# Altium project RF_Board_REV-B.PrjPcb
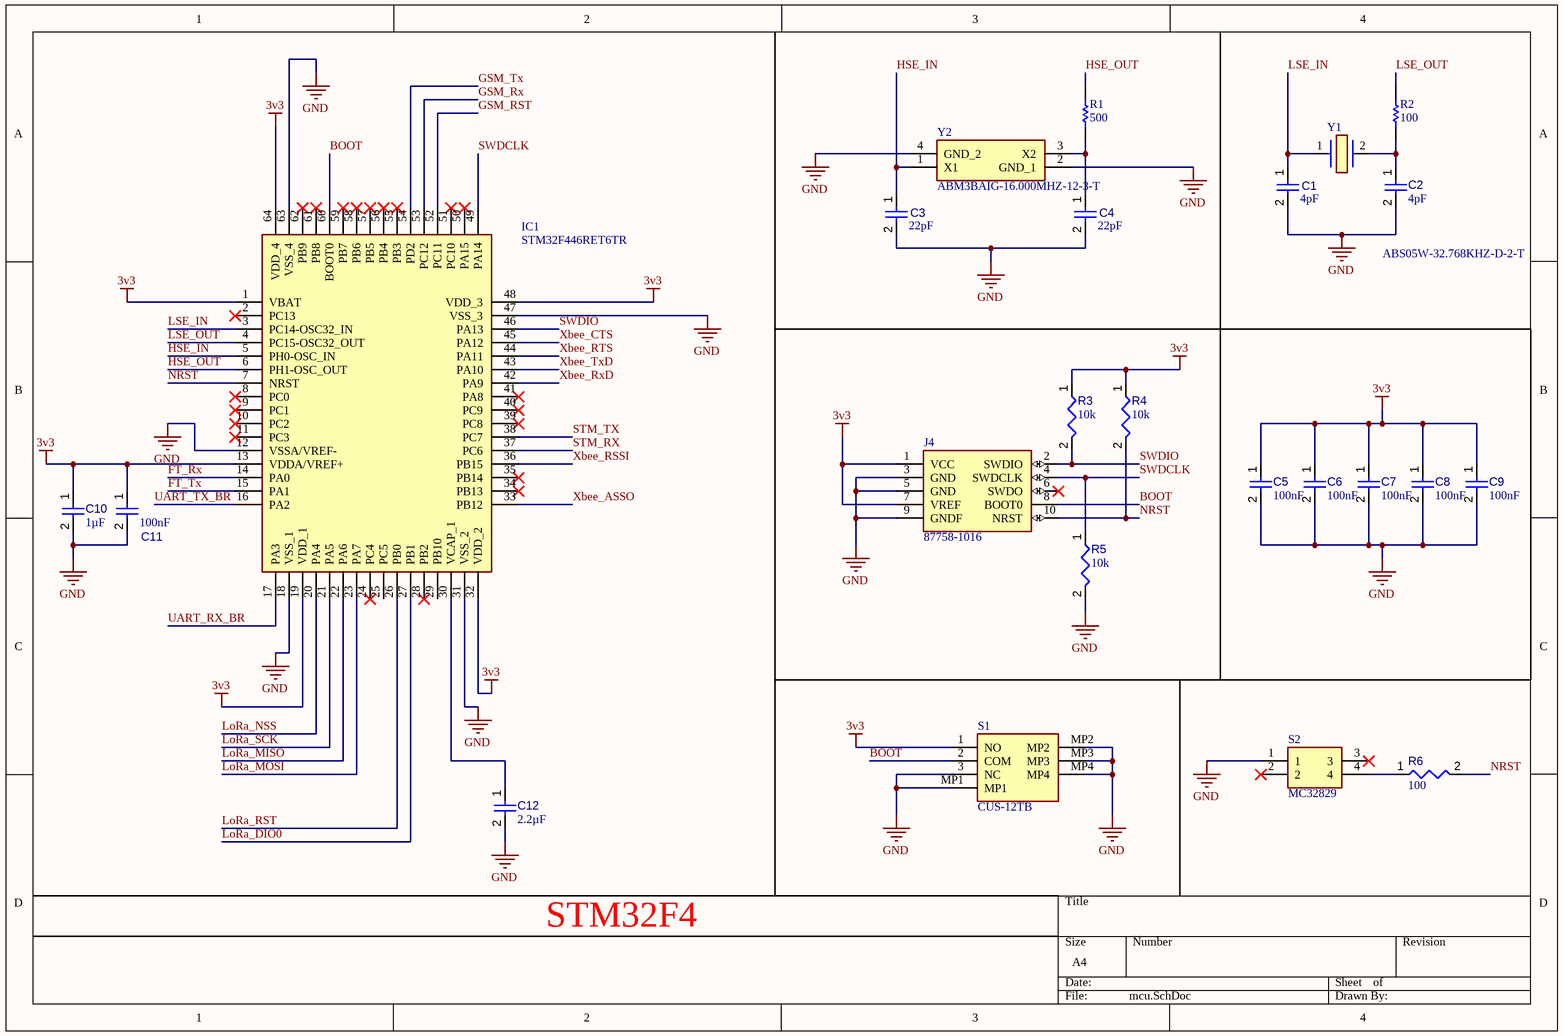
[diagram p0:  mcu.SchDoc]
3 sheets, 53 parts. Net scope: global (net labels, ports and power ports of the same name join across sheets).
Board file:  RFPCB_REV-A.PcbDoc
Sheets:
   mcu.SchDoc
   Xbee.SchDoc
   LoRa.SchDoc

## Sheet  mcu.SchDoc
size A4; SheetNumber: 1; SheetTotal: 3

### Parts
C1  value 4pF  [CAPC1608X90X40LL10T20]  (hidden comment: Capacitor 1 uF +/- 10% 25 V 0603)
C2  value 4pF  [CAPC1608X90X40LL10T20]  (hidden comment: Capacitor 1 uF +/- 10% 25 V 0603)
C3  value 22pF  [CAPC1608X90X40LL10T20]  (hidden comment: Capacitor 1 uF +/- 10% 25 V 0603)
C4  value 22pF  [CAPC1608X90X40LL10T20]  (hidden comment: Capacitor 1 uF +/- 10% 25 V 0603)
C5  value 100nF  [CAPC1608X90X40NL10T20]  (hidden comment: Capacitor 100 nF +/-10% 50 V 0603)
C6  value 100nF  [CAPC1608X90X40NL10T20]  (hidden comment: Capacitor 100 nF +/-10% 50 V 0603)
C7  value 100nF  [CAPC1608X90X40NL10T20]  (hidden comment: Capacitor 100 nF +/-10% 50 V 0603)
C8  value 100nF  [CAPC1608X90X40NL10T20]  (hidden comment: Capacitor 100 nF +/-10% 50 V 0603)
C9  value 100nF  [CAPC1608X90X40NL10T20]  (hidden comment: Capacitor 100 nF +/-10% 50 V 0603)
C10  value 1µF  [CAPC2013X135X45NL10T25]  (hidden comment: Capacitor 1 uF +/- 10% 50 V 0805)
C11  value 100nF  [CAPC1608X90X40NL10T20]  (hidden comment: Capacitor 100 nF +/-10% 50 V 0603)
C12  value 2.2µF  [CAPC2013X135X45NL10T25]  (hidden comment: Capacitor 1 uF +/- 10% 50 V 0805)
IC1  STM32F446RET6TR  [QFP50P1200X1200X160-64N]
J4  87758-1016  [HDRV10W75P200_2X5_990X400X595P]
R1  value 500  [RESC1005X40X25ML05T05]  (hidden comment: Resistor 0R +/- 5% 0402 100 mW)
R2  value 100  [RESC1005X40X25ML05T05]  (hidden comment: Resistor 0R +/- 5% 0402 100 mW)
R3  value 10k  [RESC1608X55X25ML10T15]  (hidden comment: Resistor 10k +/-1% 0603 100 mW)
R4  value 10k  [RESC1608X55X25ML10T15]  (hidden comment: Resistor 10k +/-1% 0603 100 mW)
R5  value 10k  [RESC1608X55X25ML10T15]  (hidden comment: Resistor 10k +/-1% 0603 100 mW)
R6  value 100  [RESC1608X55X25ML10T15]  (hidden comment: Resistor 10k +/-1% 0603 100 mW)
S1  CUS-12TB  [CUS12TB]
S2  MC32829  [MC32829]
Y1  ABS05W-32.768KHZ-D-2-T  [ABS05W32768KHZD2T]
Y2  ABM3BAIG-16.000MHZ-12-3-T  [ABM3BAIG]

### Nets
3v3: C5.1 C6.1 C7.1 C8.1 C9.1 C10.1 C11.1 IC1.1(VBAT) IC1.13(VDDA/VREF+) IC1.19(VDD_1) IC1.32(VDD_2) IC1.48(VDD_3) IC1.64(VDD_4) J4.1(VCC) J4.7(VREF) R3.1 R4.1 S1.1(NO)
GND: C1.2 C2.2 C3.2 C4.2 C5.2 C6.2 C7.2 C8.2 C9.2 C10.2 C11.2 C12.2 IC1.12(VSSA/VREF-) IC1.18(VSS_1) IC1.31(VSS_2) IC1.47(VSS_3) IC1.63(VSS_4) J4.3(GND) J4.5(GND) J4.9(GNDF) R5.2 S1.3(NC) S1.MP1 S1.MP2 S1.MP3 S1.MP4 S2.1 Y2.2(GND_1) Y2.4(GND_2)
BOOT: IC1.60(BOOT0) J4.8(BOOT0) S1.2(COM)
FT_Rx: IC1.14(PA0)
FT_Tx: IC1.15(PA1)
GSM_RST: IC1.52(PC11)
GSM_Rx: IC1.53(PC12)
GSM_Tx: IC1.54(PD2)
HSE_IN: C3.1 IC1.5(PH0-OSC_IN) Y2.1(X1)
HSE_OUT: IC1.6(PH1-OSC_OUT) R1.2
LoRa_DIO0: IC1.27(PB1)
LoRa_MISO: IC1.22(PA6)
LoRa_MOSI: IC1.23(PA7)
LoRa_NSS: IC1.20(PA4)
LoRa_RST: IC1.26(PB0)
LoRa_SCK: IC1.21(PA5)
LSE_IN: C1.1 IC1.3(PC14-OSC32_IN) Y1.1
LSE_OUT: IC1.4(PC15-OSC32_OUT) R2.2
NRST: IC1.7(NRST) J4.10(NRST) R4.2 R6.2
STM_RX: IC1.37(PC6)
STM_TX: IC1.38(PC7)
SWDCLK: IC1.49(PA14) J4.4(SWDCLK) R5.1
SWDIO: IC1.46(PA13) J4.2(SWDIO) R3.2
UART_RX_BR: IC1.17(PA3)
UART_TX_BR: IC1.16(PA2)
Xbee_ASSO: IC1.33(PB12)
Xbee_CTS: IC1.45(PA12)
Xbee_RSSI: IC1.36(PB15)
Xbee_RTS: IC1.44(PA11)
Xbee_RxD: IC1.42(PA9)
Xbee_TxD: IC1.43(PA10)
NetC2_1: C2.1 R2.1 Y1.2
NetC4_1: C4.1 R1.1 Y2.3(X2)
NetC12_1: C12.1 IC1.30(VCAP_1)
NetR6_1: R6.1 S2.4

Not connected (* = marked no-connect by the designer): IC1 2(PC13)* 8(PC0)* 9(PC1)* 10(PC2)* 11(PC3)* 24(PC4)* 25(PC5) 28(PB2)* 29(PB10) 34(PB13)* 35(PB14)* 39(PC8)* 40(PC9)* 41(PA8)* 50(PA15)* 51(PC10)* 55(PB3)* 56(PB4)* 57(PB5)* 58(PB6)* 59(PB7)* 61(PB8)* 62(PB9)*; J4 6(SWDO)*; S2 2* 3*

### Notes on the sheet
- STM32F4

### Library data of the parts
C1-C4 = CMP-001-00005-6: Chip Capacitor, 1 uF, +/- 10%, 25 V, 0603 (1608 Metric); Capacitor Type: Ceramic; Voltage Rating: 25V; Pins: 2; Mounting Technology: SM; RoHS Compliant: True; Max Operating Temperature: 125°C; Case/Package: 0603; Min Operating Temperature: -55°C; Tolerance: 10%
C5-C9 C11 = CMP-001-00017-6: Chip Capacitor, 100 nF, +/- 10%, 50 V, 0603 (1608 Metric); Voltage Rating: 50V; Capacitor Type: Ceramic; Tolerance: 10%; Mounting Technology: SM; Max Operating Temperature: 125°C; RoHS Compliant: True; Pins: 2; Case/Package: 0603; Min Operating Temperature: -55°C
C10 C12 = CMP-001-00007-6: Chip Capacitor, 1 uF, +/- 10%, 50 V, 0805 (2012 Metric); Capacitor Type: Ceramic; Voltage Rating: 50V; Min Operating Temperature: -55°C; RoHS Compliant: True; Mounting Technology: SM; Case/Package: 0805; Max Operating Temperature: 125°C; Tolerance: 10%; Pins: 2
IC1 = STM32F446RET6TR: Integrated Circuit; Manufacturer_Name: STMicroelectronics; Datasheet Link: https://www.arrow.com/en/products/stm32f446ret6tr/stmicroelectronics; Height: 1.6mm; Manufacturer_Part_Number: STM32F446RET6TR; Mouser Part Number: 511-STM32F446RET6TR; Mouser Price/Stock: https://www.mouser.co.uk/ProductDetail/STMicroelectronics/STM32F446RET6TR?qs=xZ%2FP%252Ba9zWqYaBJrnMqQZtg%3D%3D; Arrow Part Number: STM32F446RET6TR; Arrow Price/Stock: https://www.arrow.com/en/products/stm32f446ret6tr/stmicroelectronics?utm_currency=USD&region=nac
J4 = 87758-1016: Connector; Manufacturer_Name: Molex; Datasheet Link: http://www.molex.com/pdm_docs/sd/877581016_sd.pdf; Height: 5.95mm; Manufacturer_Part_Number: 87758-1016; Mouser Part Number: 538-87758-1016; Mouser Price/Stock: https://www.mouser.co.uk/ProductDetail/Molex/87758-1016?qs=9Wl4wMk6NjrOw5AcqxMewg%3D%3D; Arrow Part Number: 87758-1016; Arrow Price/Stock: https://www.arrow.com/en/products/87758-1016/molex?region=nac
R1 R2 = CMP-009-00005-5: Chip Resistor, 0 Ohm, 0.1 W, -55 to 155 degC, 0402 (1005 Metric); Power: 100mW; Voltage Rating: 50V; Pins: 2; Tolerance: 5%; Case/Package: 0402; Mounting Technology: SM; Max Operating Temperature: 155°C; Min Operating Temperature: -55°C; RoHS Compliant: True
R3-R6 = CMP-009-00017-5: Chip Resistor, 10 KOhm, +/- 1%, 01 W, -55 to 155 degC, 0603 (1608 Metric); Voltage Rating: 50V; Power: 100mW; RoHS Compliant: True; Min Operating Temperature: -55°C; Pins: 2; Case/Package: 0603; Mounting Technology: SM; Max Operating Temperature: 155°C; Tolerance: 1%
S1 = CUS-12TB: Switch; Manufacturer_Name: Nidec Copal; Datasheet Link: https://www.nidec-copal-electronics.com/e/catalog/switch/cus.pdf; Height: 1.4mm; Manufacturer_Part_Number: CUS-12TB; Mouser Part Number: 229-CUS-12TB; Mouser Price/Stock: https://www.mouser.co.uk/ProductDetail/Nidec-Components/CUS-12TB?qs=XeJtXLiO41Q1Ug1dC3Bq%2FQ%3D%3D
S2 = MC32829: Switch; Manufacturer_Name: Multicomp Pro; Datasheet Link: http://www.farnell.com/datasheets/2945655.pdf; Height: 6mm; Manufacturer_Part_Number: MC32829
Y1 = ABS05W-32.768KHZ-D-2-T: Crystal or Oscillator; Manufacturer_Name: ABRACON; Datasheet Link: https://abracon.com/Resonators/ABS05W.pdf; Height: 0.5mm; Manufacturer_Part_Number: ABS05W-32.768KHZ-D-2-T; Mouser Part Number: 815-ABS05W32.768KD2T; Mouser Price/Stock: https://www.mouser.co.uk/ProductDetail/ABRACON/ABS05W-32.768KHZ-D-2-T?qs=r5DSvlrkXmJ0aADBg3hvfA%3D%3D; Arrow Part Number: ABS05W-32.768KHZ-D-2-T; Arrow Price/Stock: https://www.arrow.com/en/products/abs05w-32.768khz-d-2-t/abracon?utm_currency=USD&region=nac
Y2 = ABM3BAIG-16.000MHZ-12-3-T: Crystal or Oscillator; Manufacturer_Name: ABRACON; Datasheet Link: https://abracon.com/AIGcrystals/ABM3BAIG.pdf; Height: 0.9mm; Manufacturer_Part_Number: ABM3BAIG-16.000MHZ-12-3-T

## Sheet  Xbee.SchDoc
size A4; SheetNumber: 2; SheetTotal: 3
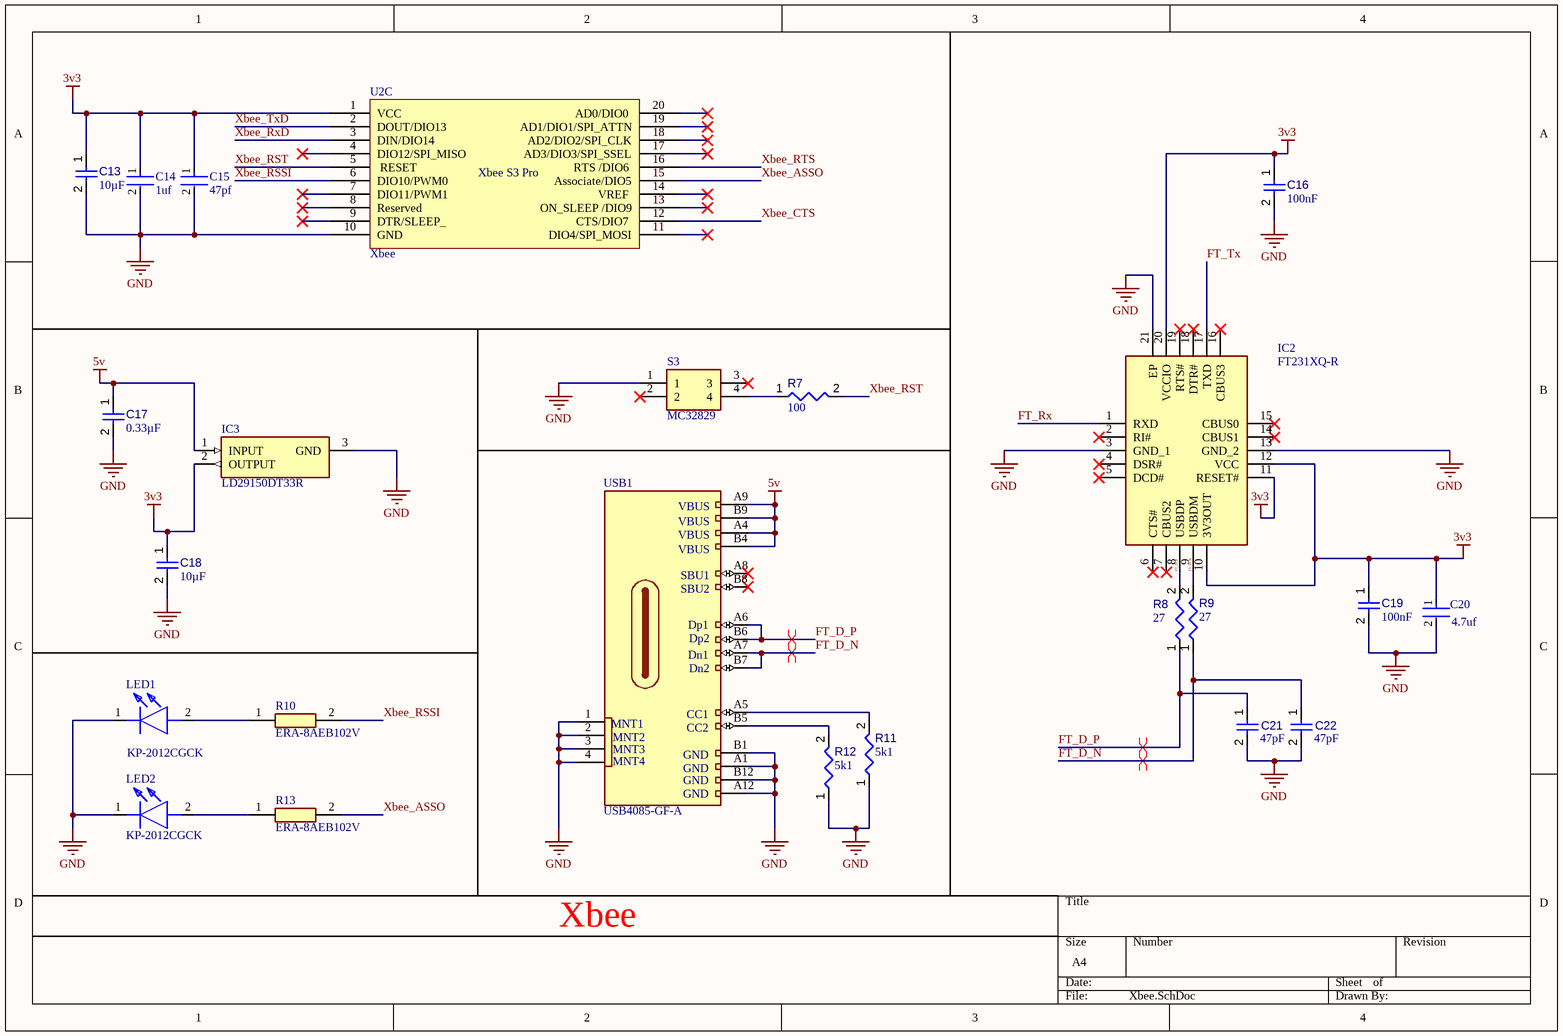
[diagram p1:  Xbee.SchDoc]

### Parts
C13  value 10µF  [CAPC3216X180X50NL20T25]  (hidden comment: Capacitor 10 uF +/- 10% 16 V 1206)
C14  1uf  [FP-CC0805-0_85-MFG]
C15  47pf  [FP-0603-L_1_6_0_15-W_0_81-IPC_A]
C16  value 100nF  [CAPC1608X90X40NL10T20]  (hidden comment: Capacitor 100 nF +/-10% 50 V 0603)
C17  value 0.33µF  [CAPC3216X180X50NL20T25]  (hidden comment: Capacitor 10 uF +/- 10% 16 V 1206)
C18  value 10µF  [CAPC3216X180X50NL20T25]  (hidden comment: Capacitor 10 uF +/- 10% 16 V 1206)
C19  value 100nF  [CAPC1608X90X40NL10T20]  (hidden comment: Capacitor 100 nF +/-10% 50 V 0603)
C20  4.7uf  [FP-CC0805-0_85-MFG]
C21  value 47pF  [CAPC1608X90X40LL10T20]  (hidden comment: Capacitor 1 uF +/- 10% 25 V 0603)
C22  value 47pF  [CAPC1608X90X40LL10T20]  (hidden comment: Capacitor 1 uF +/- 10% 25 V 0603)
IC2  FT231XQ-R  [QFN50P400X400X80-21N]
IC3  LD29150DT33R  [ST_DPAK_1]
LED1  KP-2012CGCK  [LEDC2012X110N]
LED2  KP-2012CGCK  [LEDC2012X110N]
R7  value 100  [RESC1608X55X25ML10T15]  (hidden comment: Resistor 10k +/-1% 0603 100 mW)
R8  value 27  [RESC1608X55X25ML10T15]  (hidden comment: Resistor 10k +/-1% 0603 100 mW)
R9  value 27  [RESC1608X55X25ML10T15]  (hidden comment: Resistor 10k +/-1% 0603 100 mW)
R10  ERA-8AEB102V  [RESC3216X70N]
R11  value 5k1  [RESC1608X55X25ML10T15]  (hidden comment: Resistor 10k +/-1% 0603 100 mW)
R12  value 5k1  [RESC1608X55X25ML10T15]  (hidden comment: Resistor 10k +/-1% 0603 100 mW)
R13  ERA-8AEB102V  [RESC3216X70N]
S3  MC32829  [MC32829]
U2  Xbee  [Xbee]  (part C of 3)
USB1  USB4085-GF-A  [USB4085-GF-A]

### Nets
3v3: C13.1 C14.1 C15.1 C16.1 C18.1 C19.1 C20.1 IC2.10(3V3OUT) IC2.11(RESET#) IC2.12(VCC) IC2.20(VCCIO) IC3.2(OUTPUT) U2.1(VCC)
5v: C17.1 IC3.1(INPUT) USB1.A4(VBUS) USB1.A9(VBUS) USB1.B4(VBUS) USB1.B9(VBUS)
GND: C13.2 C14.2 C15.2 C16.2 C17.2 C18.2 C19.2 C20.2 C21.2 C22.2 IC2.3(GND_1) IC2.13(GND_2) IC2.21(EP) IC3.3(GND) LED1.1(K) LED2.1(K) R11.1 R12.1 S3.1 U2.10(GND) USB1.1(MNT_1) USB1.2(MNT_2) USB1.3(MNT_3) USB1.4(MNT_4) USB1.A1(GND) USB1.A12(GND) USB1.B1(GND) USB1.B12(GND)
FT_D_N: C22.1 IC2.9(USBDM) R9.1 R9.2 USB1.A7(Dn1) USB1.B7(Dn2)
FT_D_P: C21.1 IC2.8(USBDP) R8.1 R8.2 USB1.A6(Dp1) USB1.B6(Dp2)
FT_Rx: IC2.1(RXD)
FT_Tx: IC2.17(TXD)
Xbee_ASSO: R13.2 U2.15(Associate/DIO5)
Xbee_CTS: U2.12(CTS/DIO7)
Xbee_RSSI: R10.2 U2.6(DIO10/PWM0)
Xbee_RST: R7.2 U2.5(RESET)
Xbee_RTS: U2.16(RTS_/DIO6)
Xbee_RxD: U2.3(DIN/DIO14)
Xbee_TxD: U2.2(DOUT/DIO13)
NetLED1_2: LED1.2(A) R10.1
NetLED2_2: LED2.2(A) R13.1
NetR7_1: R7.1 S3.4
NetR11_2: R11.2 USB1.A5(CC1)
NetR12_2: R12.2 USB1.B5(CC2)

Not connected (* = marked no-connect by the designer): IC2 2(RI#)* 4(DSR#)* 5(DCD#)* 6(CTS#)* 7(CBUS2)* 14(CBUS1)* 15(CBUS0)* 16(CBUS3)* 18(DTR#)* 19(RTS#)*; S3 2* 3*; U2 4(DIO12/SPI_MISO)* 7(DIO11/PWM1_)* 8(Reserved_)* 9(DTR/SLEEP_)* 11(DIO4/SPI_MOSI)* 13(ON_SLEEP_/DIO9)* 14(VREF_)* 17(AD3/DIO3/SPI_SSEL)* 18(AD2/DIO2/SPI_CLK)* 19(AD1/DIO1/SPI_ATTN)* 20(AD0/DIO0_)*; USB1 A8(SBU1)* B8(SBU2)*

### Layout directives
differential pair: FT_D_N, FT_D_P

### Notes on the sheet
- Xbee

### Library data of the parts
C13 C17 C18 = CMP-001-00016-6: Chip Capacitor, 10 uF, +/- 10%, 16 V, 1206 (3216 Metric); Capacitor Type: Ceramic; Voltage Rating: 16V; Tolerance: 10%; Min Operating Temperature: -55°C; Pins: 2; Mounting Technology: SM; Case/Package: 1206; Max Operating Temperature: 125°C; RoHS Compliant: True
C14 C20 = CMP-2100-03606-3: CAP CER 0.1UF 50V X7R 0805; Manufacturer Part Number: CC0805KRX7R9BB104; Manufacturer: Yageo; Tolerance: 0.1; Capacitance: 100 nF; Value: 100 nF; Material: Ceramic; Device Class L1: Passive Components; ComponentLink2Description: Datasheet; Package: CC0805-0.85; Digikey Description: CAP CER 0.1UF 50V X7R 0805; Device Class L3: Ceramic Capacitors; Temperature: -30°C to +85°C; Temperature Characteristic: X7R; Voltage Rating: 50 V; Height: 0.95mm; RoHS: TRUE; Ipc Land Pattern Name: CAPC200125X85; Device Class L2: Capacitors; Category: Cap; Temperature Range Low: -30°C; Temperature Range High: +85°C; Mouser Description: Multilayer Ceramic Capacitors MLCC - SMD/SMT 100nF 50V X7R 10%; Footprint Url: http://www.yageo.com/exep/pages/download/literatures/UPY-C_GEN_24.pdf; Automotive: No; Octopart: https://octopart.com/cc0805krx7r9bb104-yageo-192993; Lead Free: Yes; ComponentLink2URL: http://www.yageo.com/documents/recent/UPY-GPHC_Y5V_6.3V-to-50V_8.pdf
C15 = CMP-2006-04378-2: General Purpose Ceramic Capacitor, 0603, 1nF, 10%, X7R, 15%, 50V; Case Code (Metric): 1608; Min Operating Temperature: -55°C; Weight: 7.1E-05oz; Series: -; Capacitance: 1nF; RoHS Compliant: Yes; Radiation Hardening: No; Height: 0.9mm; Mount: Surface Mount; REACH SVHC: No SVHC; Lead Free: Lead Free; Depth: 0.81mm; Voltage: 50V; Number of Pins: 2; Voltage Rating: 50V; Max Operating Temperature: 125°C; Termination: SMD/SMT; Construction: Flat; Case Code (Imperial): 0603; Dielectric: X7R; Width: 0.032inch; Tolerance: 10%; Case/Package: 0603; Contact Plating: Tin; Packaging: Tape and Reel; Voltage Rating (DC): 50V; Dielectric Material: Ceramic; Package Quantity: 4000; Thickness: 0.035inch; Length: 1.6mm
C16 C19 = CMP-001-00017-6: as C5 on sheet  mcu; Tolerance: 10%; Mounting Technology: SM; Max Operating Temperature: 125°C; RoHS Compliant: True; Pins: 2; Case/Package: 0603; Min Operating Temperature: -55°C
C21 C22 = CMP-001-00005-6: as C1 on sheet  mcu; Pins: 2; Mounting Technology: SM; RoHS Compliant: True; Max Operating Temperature: 125°C; Case/Package: 0603; Min Operating Temperature: -55°C; Tolerance: 10%
IC2 = FT231XQ-R: Integrated Circuit; Manufacturer_Name: FTDI Chip; Datasheet Link: http://www.ftdichip.com/Support/Documents/DataSheets/ICs/DS_FT231X.pdf; Height: 0.8mm; Manufacturer_Part_Number: FT231XQ-R; Mouser Part Number: 895-FT231XQ-R; Mouser Price/Stock: https://www.mouser.co.uk/ProductDetail/FTDI/FT231XQ-R?qs=Gp1Yz1mis3VkAf3iW%252BkumQ%3D%3D; Arrow Part Number: FT231XQ-R; Arrow Price/Stock: https://www.arrow.com/en/products/ft231xq-r/ftdi-chip?region=nac
IC3 = LD29150DT33R: Integrated Circuit; Manufacturer_Name: STMicroelectronics; Datasheet Link: http://www.st.com/web/en/resource/technical/document/datasheet/CD00003403.pdf; Manufacturer_Part_Number: LD29150DT33R; Mouser Part Number: 511-LD29150DT33R; Mouser Price/Stock: https://www.mouser.co.uk/ProductDetail/STMicroelectronics/LD29150DT33R?qs=M4RLcaOHglr1iYLz8rxZ4g%3D%3D; Arrow Part Number: LD29150DT33R; Arrow Price/Stock: https://www.arrow.com/en/products/ld29150dt33r/stmicroelectronics?region=nac
LED1 LED2 = KP-2012CGCK: LED; Manufacturer_Name: Kingbright; Datasheet Link: https://componentsearchengine.com/Datasheets/2/KP-2012CGCK.pdf; Height: 1.1mm; Manufacturer_Part_Number: KP-2012CGCK; Mouser Part Number: N/A; Mouser Price/Stock: https://www.mouser.co.uk/ProductDetail/Kingbright/KP-2012CGCK?qs=2JU0tDl2GZ3tjMUbXin2qw%3D%3D; Arrow Part Number: KP-2012CGCK; Arrow Price/Stock: https://www.arrow.com/en/products/kp-2012cgck/kingbright?utm_currency=USD&region=europe
R7-R9 R11 R12 = CMP-009-00017-5: as R3 on sheet  mcu; RoHS Compliant: True; Min Operating Temperature: -55°C; Pins: 2; Case/Package: 0603; Mounting Technology: SM; Max Operating Temperature: 155°C; Tolerance: 1%
R10 R13 = ERA-8AEB102V: Resistor; Manufacturer_Name: Panasonic; Datasheet Link: https://industrial.panasonic.com/cdbs/www-data/pdf/RDM0000/AOA0000C307.pdf; Height: 0.7mm; Manufacturer_Part_Number: ERA-8AEB102V; Mouser Part Number: 667-ERA-8AEB102V; Mouser Price/Stock: https://www.mouser.co.uk/ProductDetail/Panasonic/ERA-8AEB102V?qs=Ojoo2rCVP9R3RwZw0XjknA%3D%3D; Arrow Part Number: ERA-8AEB102V; Arrow Price/Stock: https://www.arrow.com/en/products/era-8aeb102v/panasonic?utm_currency=USD&region=nac
S3 = MC32829: Switch; Manufacturer_Name: Multicomp Pro; Datasheet Link: http://www.farnell.com/datasheets/2945655.pdf; Height: 6mm; Manufacturer_Part_Number: MC32829

## Sheet  LoRa.SchDoc
size A4; SheetNumber: 3; SheetTotal: 3
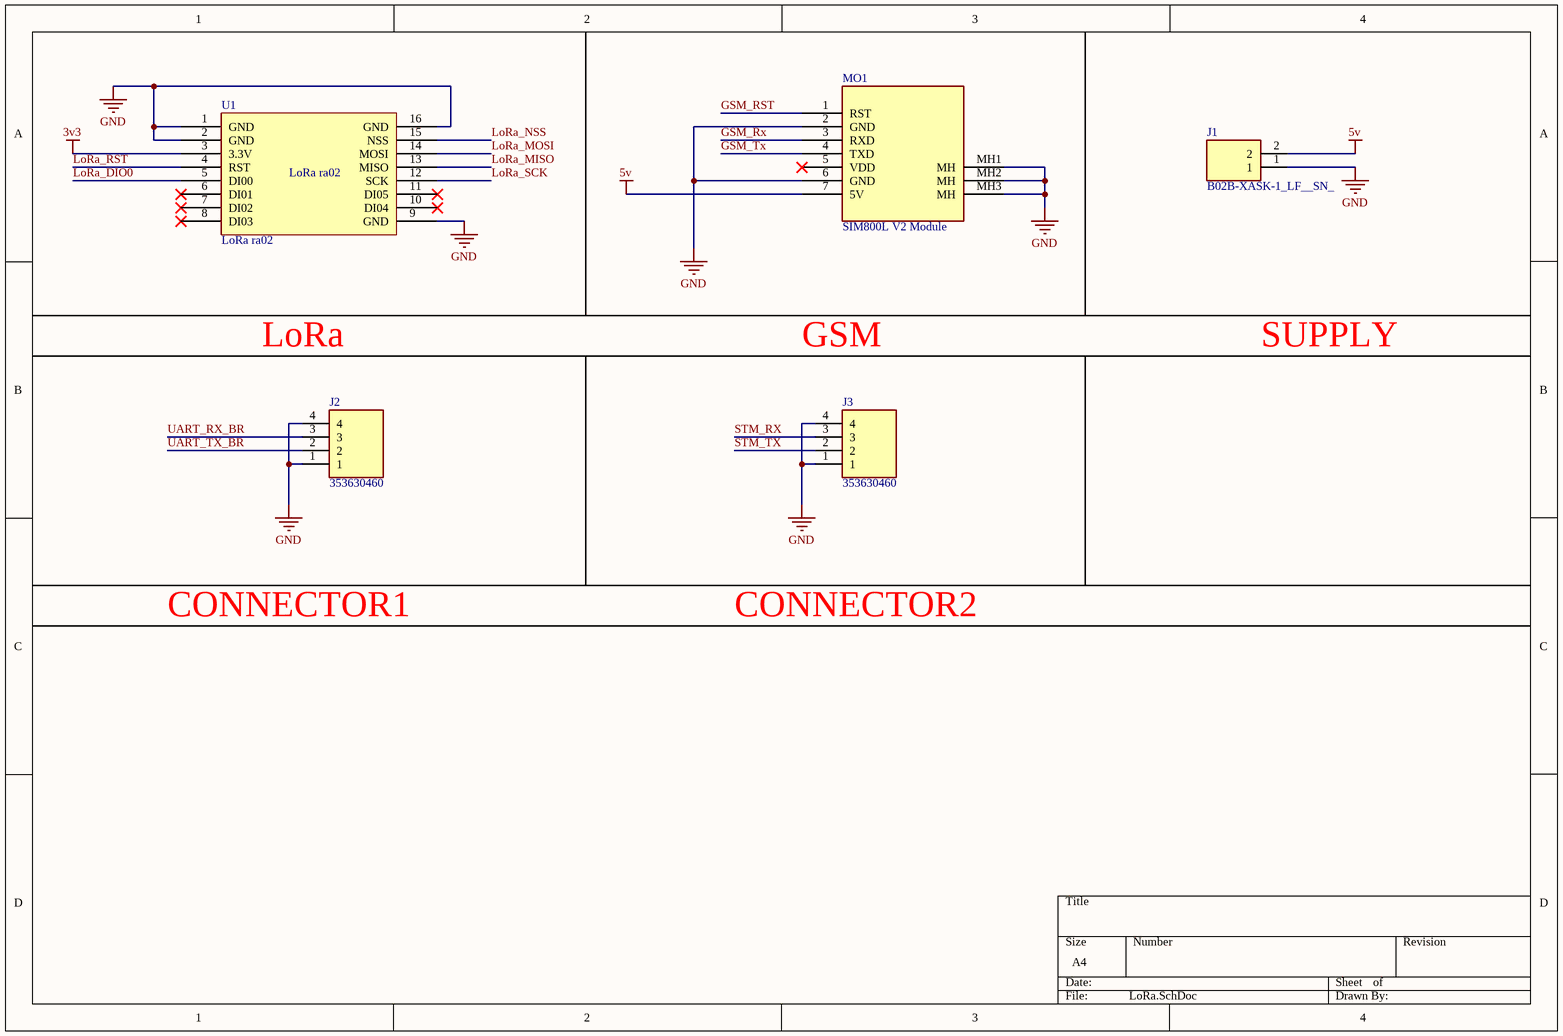
[diagram p2:  LoRa.SchDoc]

### Parts
J1  B02B-XASK-1_LF__SN_  [SHDR2W60P0X250_1X2_750X640X880P]
J2  353630460  [353630460]
J3  353630460  [353630460]
MO1  SIM800L V2 Module  [SIM800LV2.0]
U1  LoRa ra02  [LoRa]

### Nets
3v3: U1.3(3.3V)
5v: J1.2 MO1.7(5V)
GND: J1.1 J2.1 J2.4 J3.1 J3.4 MO1.2(GND) MO1.6(GND) MO1.MH1(MH) MO1.MH2(MH) MO1.MH3(MH) U1.1(GND) U1.2(GND) U1.9(GND) U1.16(GND)
GSM_RST: MO1.1(RST)
GSM_Rx: MO1.3(RXD)
GSM_Tx: MO1.4(TXD)
LoRa_DIO0: U1.5(DI00)
LoRa_MISO: U1.13(MISO)
LoRa_MOSI: U1.14(MOSI)
LoRa_NSS: U1.15(NSS)
LoRa_RST: U1.4(RST)
LoRa_SCK: U1.12(SCK)
STM_RX: J3.3
STM_TX: J3.2
UART_RX_BR: J2.3
UART_TX_BR: J2.2

Not connected (* = marked no-connect by the designer): MO1 5(VDD)*; U1 6(DI01)* 7(DI02)* 8(DI03)* 10(DI04)* 11(DI05)*

### Notes on the sheet
- LoRa
- GSM
- SUPPLY
- CONNECTOR1
- CONNECTOR2

### Library data of the parts
J1 = B02B-XASK-1_LF__SN_: Connector; Manufacturer_Name: JST (JAPAN SOLDERLESS TERMINALS); Manufacturer_Part_Number: B02B-XASK-1(LF)(SN); Datasheet Link: http://www.jst-mfg.com/product/pdf/eng/eXA1.pdf; Height: 8.8mm; Mouser Part Number: N/A; Mouser Price/Stock: https://www.mouser.co.uk/ProductDetail/JST-Commercial/B02B-XASK-1LFSN?qs=IKkN%2F947nfBty2GocXf7QA%3D%3D; Arrow Part Number: B02B-XASK-1(LF)(SN); Arrow Price/Stock: https://www.arrow.com/en/products/b02b-xask-1-lf-sn/jst-manufacturing?utm_currency=USD&region=europe
J2 J3 = 353630460: Connector; Manufacturer_Name: Molex; Datasheet Link: https://www.molex.com/pdm_docs/sd/353630260_sd.pdf; Height: 5.5mm; Manufacturer_Part_Number: 353630460; Arrow Part Number: 353630460; Arrow Price/Stock: https://www.arrow.com/en/products/35363-0460/molex?region=nac
MO1 = SIM800LV2.0: GSM Module
U1 = LoRa ra02: gg

## Nets that join several sheets
3v3:  mcu (18 pins),  Xbee (13 pins),  LoRa (U1.3)
5v:  Xbee (6 pins),  LoRa (J1.2 MO1.7)
GND:  mcu (29 pins),  Xbee (28 pins),  LoRa (14 pins)
FT_Rx:  mcu (IC1.14),  Xbee (IC2.1)
FT_Tx:  mcu (IC1.15),  Xbee (IC2.17)
GSM_RST:  mcu (IC1.52),  LoRa (MO1.1)
GSM_Rx:  mcu (IC1.53),  LoRa (MO1.3)
GSM_Tx:  mcu (IC1.54),  LoRa (MO1.4)
LoRa_DIO0:  mcu (IC1.27),  LoRa (U1.5)
LoRa_MISO:  mcu (IC1.22),  LoRa (U1.13)
LoRa_MOSI:  mcu (IC1.23),  LoRa (U1.14)
LoRa_NSS:  mcu (IC1.20),  LoRa (U1.15)
LoRa_RST:  mcu (IC1.26),  LoRa (U1.4)
LoRa_SCK:  mcu (IC1.21),  LoRa (U1.12)
STM_RX:  mcu (IC1.37),  LoRa (J3.3)
STM_TX:  mcu (IC1.38),  LoRa (J3.2)
UART_RX_BR:  mcu (IC1.17),  LoRa (J2.3)
UART_TX_BR:  mcu (IC1.16),  LoRa (J2.2)
Xbee_ASSO:  mcu (IC1.33),  Xbee (R13.2 U2.15)
Xbee_CTS:  mcu (IC1.45),  Xbee (U2.12)
Xbee_RSSI:  mcu (IC1.36),  Xbee (R10.2 U2.6)
Xbee_RTS:  mcu (IC1.44),  Xbee (U2.16)
Xbee_RxD:  mcu (IC1.42),  Xbee (U2.3)
Xbee_TxD:  mcu (IC1.43),  Xbee (U2.2)